# EasyEDA schematic 1-Schematic_barbot_version1.json
TITLE: Sheet_1; REV: 1.0; Date: 2025-12-08; Sheet: 1/1; Drawn By: susann.baldiviezo; Company: Your Company
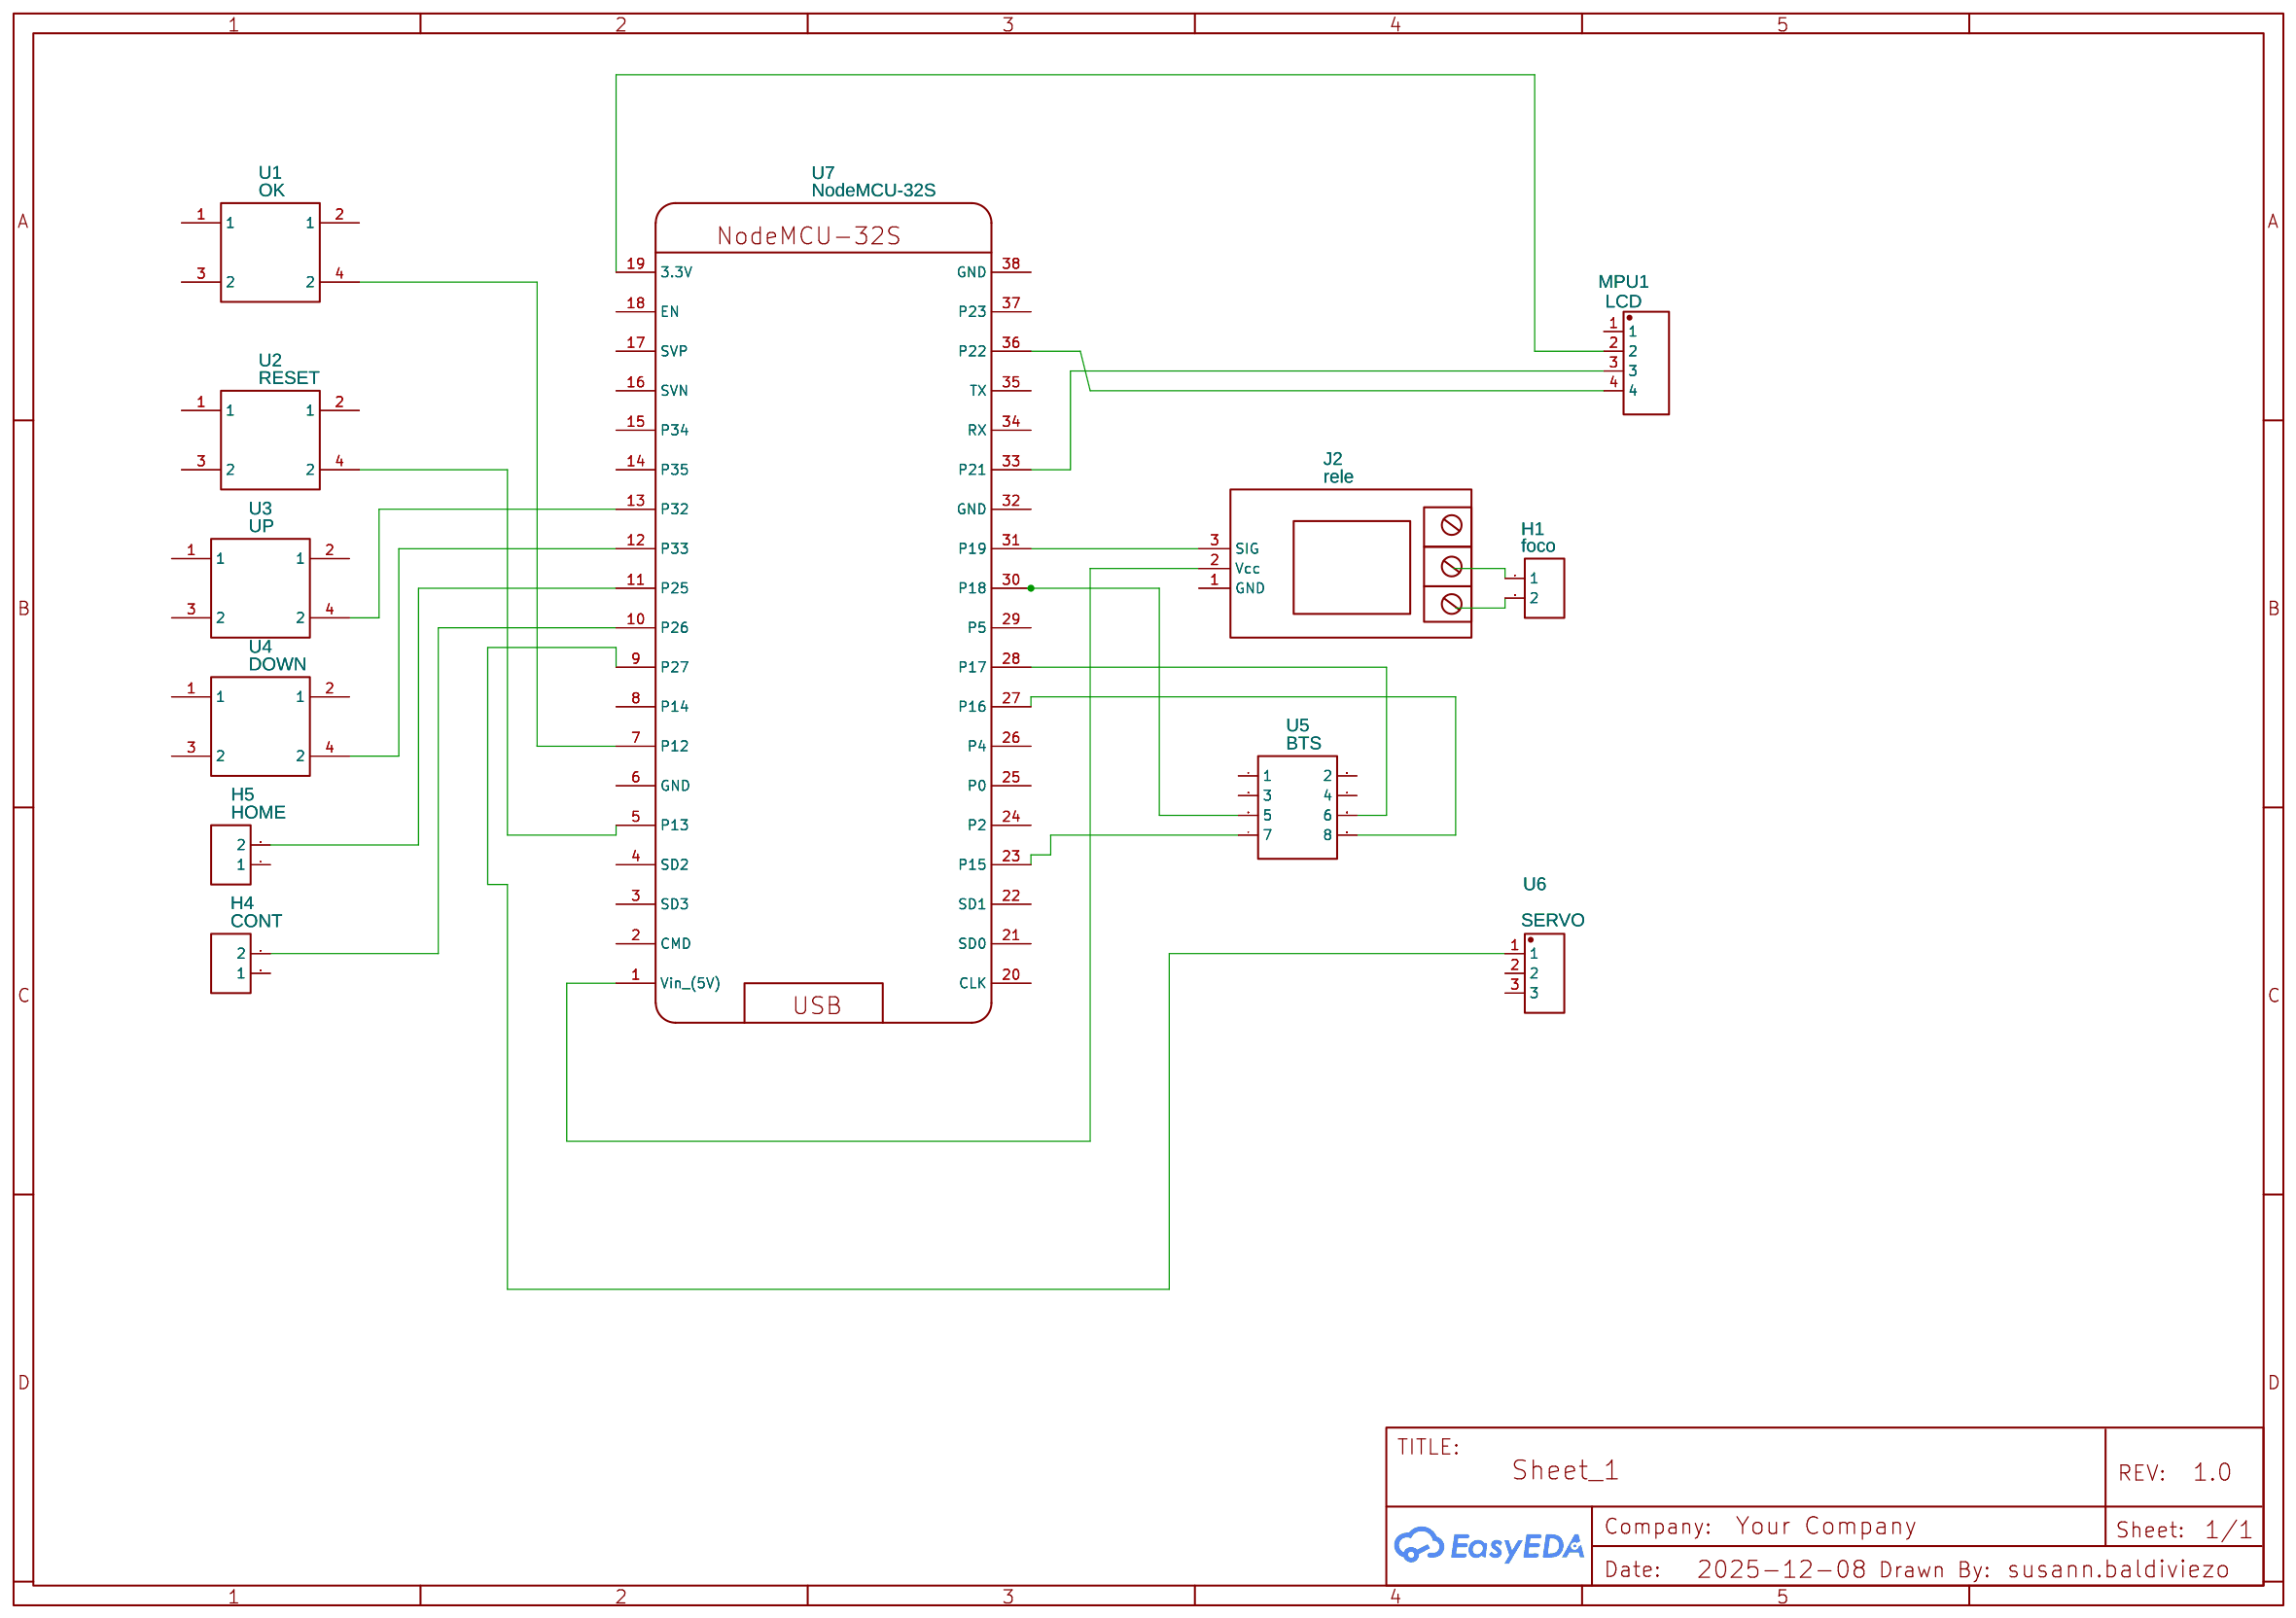
[diagram p0: schematic sheet]

## Parts
H1  foco  [HEADER-FEMALE-2.54_1X2]
H4  CONT  [HEADER-FEMALE-2.54_1X2]
H5  HOME  [HEADER-FEMALE-2.54_1X2]
J2  rele  [RELAY MODULE 1 RELAYS]
MPU1  LCD  [HEADER-FEMALE-2.54_1X4]
U1  OK  [BOTON PULSADOR 12X12MM]
U2  RESET  [BOTON PULSADOR 12X12MM]
U3  UP  [BOTON PULSADOR 12X12MM]
U4  DOWN  [BOTON PULSADOR 12X12MM]
U5  BTS  [HEADER-FEMALE-2.54_2X4]
U6  SERVO  [HEADER-FEMALE-2.54_1X3 FOOTPRINT]
U7  NodeMCU-32S  [NODEMCU-32SLUA]

## Library data of the parts
H1 H4 H5 = HEADER-FEMALE-2.54_1X2 COPY: Contributor: kamicane
J2 = 1 CHANNEL RELAY MODULE: Manufacturer Part: 1-Channel 5V Relay Module w/ Opto-isolator; Supplier Part: SKU: 223429; link: http://www.volumerate.com/product/1-channel-5v-relay-module-w-opto-isolator-red-blue-223429; Contributor: muhamad.ivan.ramadhan.te23
MPU1 = HEADER-FEMALE-2.54_1X4: Contributor: kloutan
U1-U4 = Boton pulsador 12x12mm: Contributor: juancarlos15466226
U5 = Header-Female-2.54_2x10: Manufacturer Part: 2.54mm,2×4Double row female; Contributor: ppbpm
U6 = HEADER-FEMALE-2.54_1X3: Contributor: kloutan
U7 = NodeMCU-32S: Supplier: LCSC; Supplier Part: C111436; Manufacturer: Ai-Thinker; Manufacturer Part: NodeMCU-32SLua; Contributor: cocus; link: https://lcsc.com/product-detail/Modules_NodeMCU-32S-Lua_C111436.html

## Nets
Net-(H4-2): H4.2 U7.10(P26)
Net-(H5-2): H5.2 U7.11(P25)
Net-(J2-2): J2.2(Vcc) U7.1(Vin (5V))
Net-(J2-3): J2.3(SIG) U7.31(P19)
Net-(MPU1-2): MPU1.2 U7.19(3.3V)
Net-(MPU1-3): MPU1.3 U7.33(P21)
Net-(MPU1-4): MPU1.4 U7.36(P22)
Net-(U1-4): U1.4(2) U7.7(P12)
Net-(U2-4): U2.4(2) U7.5(P13)
Net-(U3-4): U3.4(2) U7.13(P32)
Net-(U4-4): U4.4(2) U7.12(P33)
Net-(U5-5): U5.5 U7.30(P18)
Net-(U5-6): U5.6 U7.28(P17)
Net-(U5-7): U5.7 U7.23(P15)
Net-(U5-8): U5.8 U7.27(P16)
Net-(U6-1): U6.1 U7.9(P27)

Not connected (* = marked no-connect by the designer): H1 1 2; H4 1; H5 1; J2 1(GND); MPU1 1; U1 1 2(1) 3(2); U2 1 2(1) 3(2); U3 1 2(1) 3(2); U4 1 2(1) 3(2); U5 1 2 3 4; U6 2 3; U7 2(CMD) 3(SD3) 4(SD2) 6(GND) 8(P14) 14(P35) 15(P34) 16(SVN) 17(SVP) 18(EN) 20(CLK) 21(SD0) 22(SD1) 24(P2) 25(P0) 26(P4) 29(P5) 32(GND) 34(RX) 35(TX) 37(P23) 38(GND)
